# EAGLE design ETAG_v10.0_EM4095 (EAGLE 7.5.0)

## Sheet 1 of 2
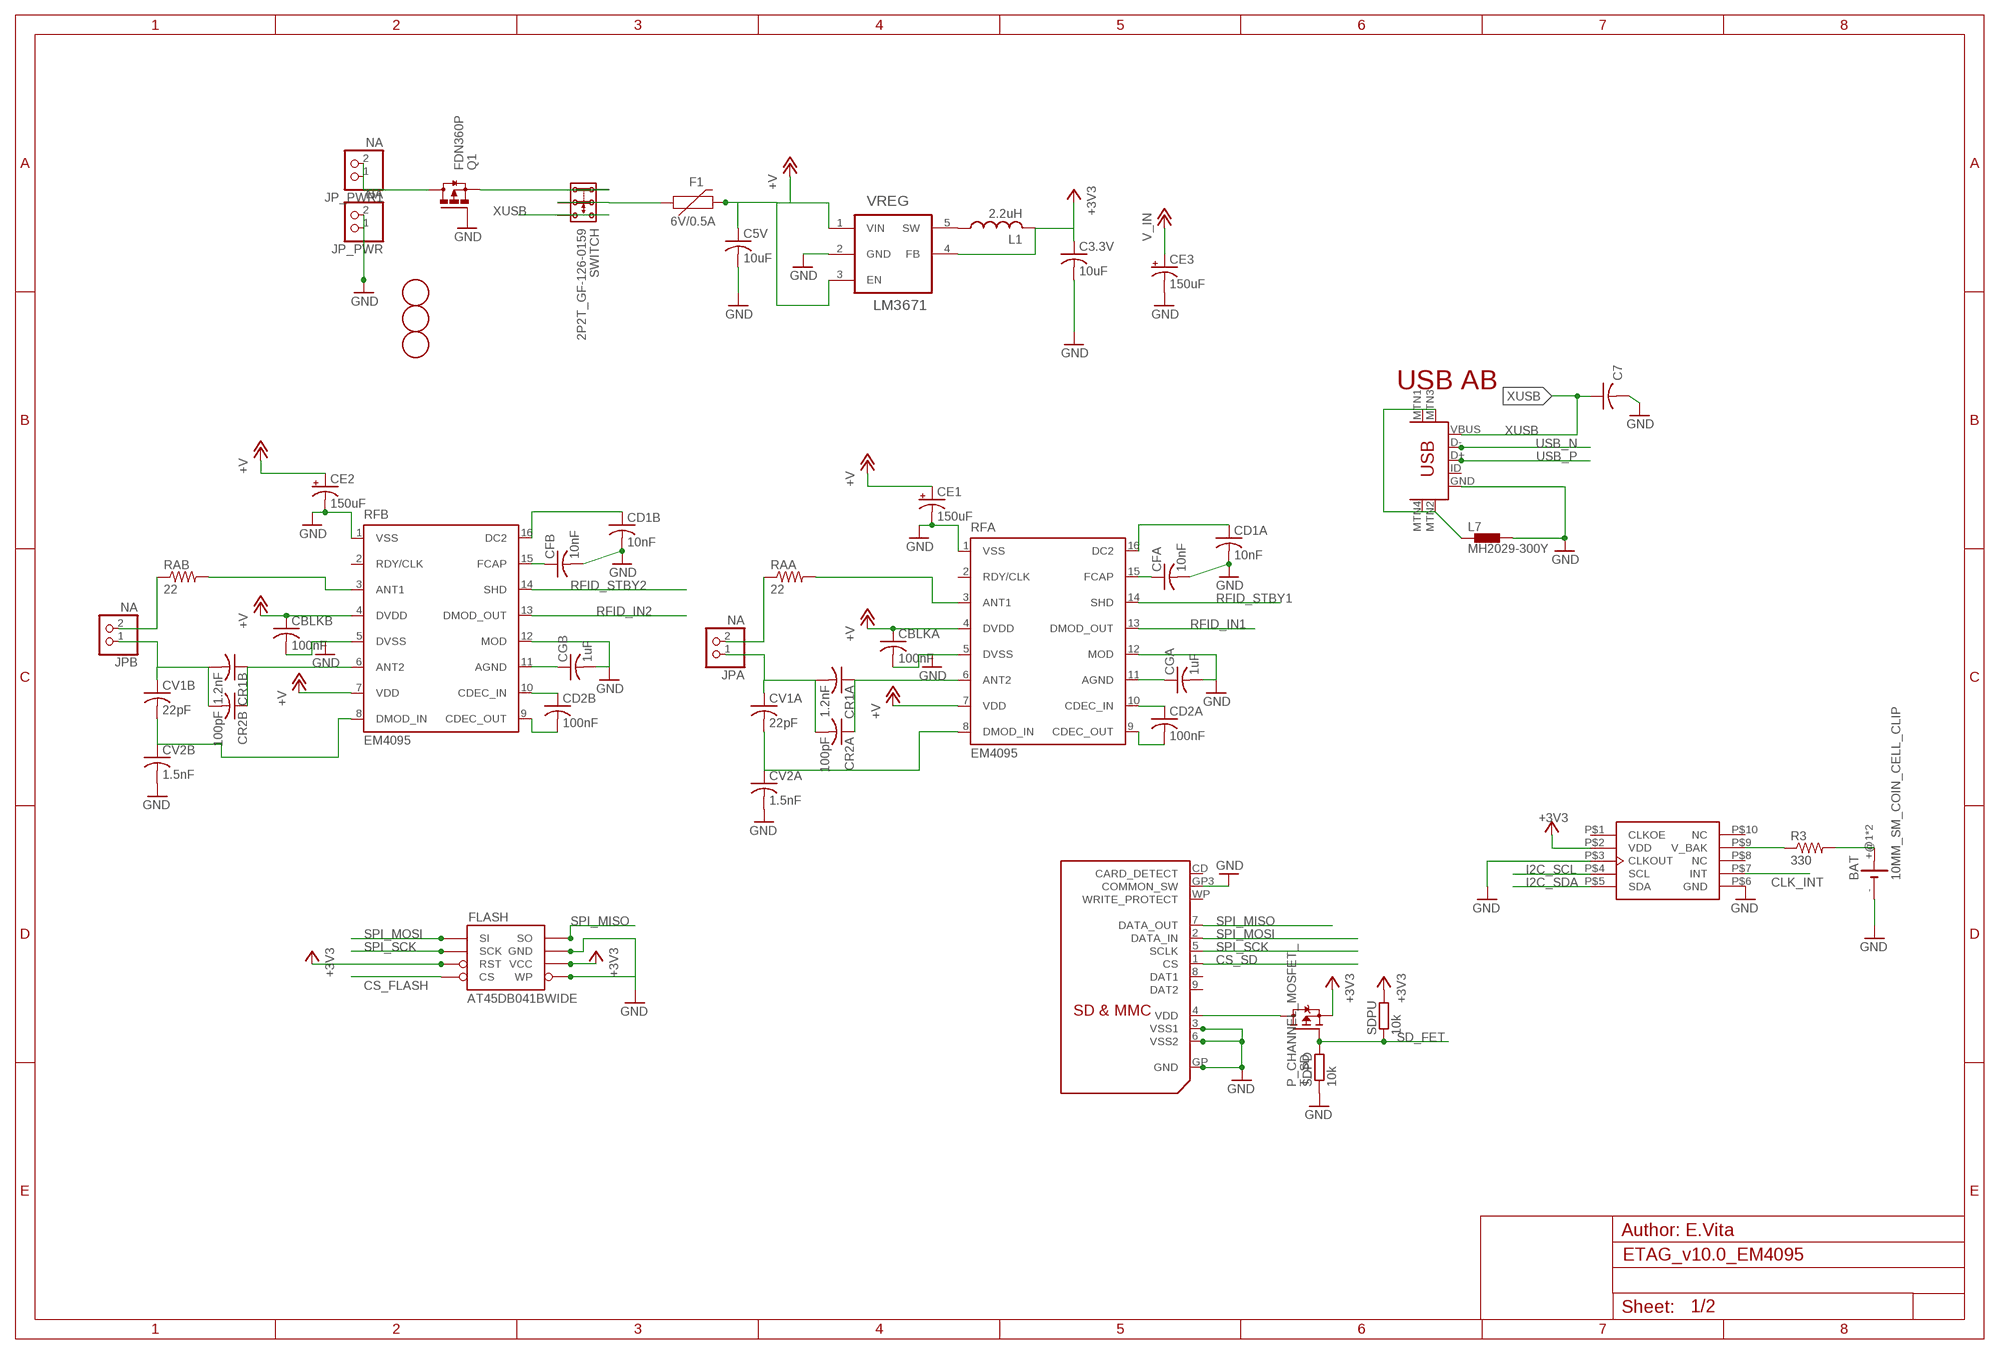
[diagram p0: schematic, sheet 1]

### Parts
BAT  10MM_SM_COIN_CELL_CLIP  [10MM_SM_COIN_CELL_CLIP]
C3.3V  10uF  C-USC0805  [C0805]
C5V  10uF  C-USC0805  [C0805]
C7  10nF  C-USROUND  [C0603-ROUND]
CBLKA  100nF  C-US  [C0603-ROUND]
CBLKB  100nF  C-US  [C0603-ROUND]
CD1A  10nF  C-US  [C0603-ROUND]
CD1B  10nF  C-USROUND  [C0603-ROUND]
CD2A  100nF  C-US  [C0603-ROUND]
CD2B  100nF  C-US  [C0603-ROUND]
CE1  150uF  CPOL-USE2-5  [E2-5]
CE2  150uF  CPOL-USE2-5  [E2-5]
CE3  150uF  CPOL-USE2-5  [E2-5]
CFA  10nF  C-USROUND  [C0603-ROUND]
CFB  10nF  C-US  [C0603-ROUND]
CGA  1uF  C-US  [C0603-ROUND]
CGB  1uF  C-US  [C0603-ROUND]
CR1A  1.2nF  C-USROUND  [C0603-ROUND]
CR1B  1.2nF  C-US  [C0603-ROUND]
CR2A  100pF  C-US  [C0603-ROUND]
CR2B  100pF  C-US  [C0603-ROUND]
CV1A  22pF  C-US  [C0603-ROUND]
CV1B  22pF  C-US  [C0603-ROUND]
CV2A  1.5nF  C-USROUND  [C0603-ROUND]
CV2B  1.5nF  C-US  [C0603-ROUND]
F1  6V/0.5A  PPTC_6V500MA-2  [1206]
FD1  FIDUCIALMOUNT  [FIDUCIA-MOUNT]
FD2  FIDUCIALMOUNT  [FIDUCIA-MOUNT]
FD3  FIDUCIALMOUNT  [FIDUCIA-MOUNT]
FLASH  AT45DB041BWIDE  [SO08WIDE]
JP_PWR  NA  PINHD-1X2  [1X02]
JP_PWR1  NA  PINHD-1X2  [1X02]
JPA  NA  PINHD-1X2  [1X02]
JPB  NA  PINHD-1X2  [1X02]
L1  2.2uH  L-US4X4  [SMT_COIL_INDUCTOR_4X4MM]
L7  MH2029-300Y  BLM15H0805  [C0805K]
Q1  FDN360P  [SUPER-SOT3]
R3  330  R-US_ROUND  [C0603-ROUND]
RAA  22  R-US_R0805  [R0805]
RAB  22  R-US_R0805  [R0805]
RFA  EM4095  [SO16]
RFB  EM4095  [SO16]
RTC  MC-RTC-RV-3029-C3-I2C  [MC-RTC-C3_SPECIAL]
SD  SDMMC06132  [06132]
SDPD  10k  0028_CR0603JW103L  [R0603-ROUND]
SDPU  10k  0028_CR0603JW103L  [R0603-ROUND]
SWITCH  2P2T_GF-126-0159  [2P2T_GF-126-0159]
T_SD  P_CHANNEL_MOSFET_  [SOT23]
USB  USB-MINIB-5PIN  [USB-MINIB]
VREG  LM3671  LM3671_SWITCHING_REGSOT23  [SOT23-5L]

### Nets
2GND [gnd]: L7.1 USB.MTN1(MTN2) USB.MTN2(MTN3) USB.MTN3(MTN1) USB.MTN4
12_IN: JP_PWR1.1 JP_PWR1.2 Q1.3(D)
+3V3: C3.3V.1 FLASH.3(RST) FLASH.6(VCC) L1.P$2 RTC.P$2(VDD) SDPU.2 T_SD.2(S) VREG.4(FB) ; also sheet 2
CLK_INT: RTC.P$7(INT) ; also sheet 2
CS_FLASH: FLASH.4(CS) ; also sheet 2
CS_SD: SD.1(CS) ; also sheet 2
CVB: CR1B.2 CR2B.2 CV1B.1 JPB.1
GND [gnd]: BAT.- C3.3V.2 C5V.2 C7.2 CBLKA.2 CBLKB.2 CD1A.2 CD1B.2 CE1.- CE2.- CE3.- CFA.2 CFB.2 CGA.2 CGB.2 CV2A.2 CV2B.2 FLASH.5(WP) FLASH.7(GND) JP_PWR.1 JP_PWR.2 L7.2 Q1.1(G) RFA.1(VSS) RFA.5(DVSS) RFA.12(MOD) RFB.1(VSS) RFB.5(DVSS) RFB.12(MOD) RTC.P$3(CLKOUT) RTC.P$6(GND) SD.3(VSS1) SD.6(VSS2) SD.GP3(COMMON_SW) SD.GP(GND) SDPD.1 USB.GND VREG.2(GND) ; also sheet 2
I2C_SCL: RTC.P$4(SCL) ; also sheet 2
I2C_SDA: RTC.P$5(SDA) ; also sheet 2
N$2: CFB.1 RFB.15(FCAP)
N$3: CGB.1 RFB.11(AGND)
N$4: CFA.1 RFA.15(FCAP)
N$5: CGA.1 RFA.11(AGND)
N$6: CD1A.1 RFA.16(DC2)
N$7: CR1B.1 CR2B.1 RFB.6(ANT2)
N$8: CV1B.2 CV2B.1 RFB.8(DMOD_IN)
N$9: CD1B.1 RFB.16(DC2)
N$10: F1.1 SWITCH.P2A(2.1) SWITCH.P2B(2.2)
N$11: CD2B.2 RFB.9(CDEC_OUT)
N$12: CR1A.1 CR2A.1 RFA.6(ANT2)
N$13: CV1A.2 CV2A.1 RFA.8(DMOD_IN)
N$14: CR1A.2 CR2A.2 CV1A.1 JPA.1
N$15: CD2B.1 RFB.10(CDEC_IN)
N$16: RAB.2 RFB.3(ANT1)
N$17: Q1.2(S) SWITCH.P1A(1.1) SWITCH.P1B(1.2)
N$18: CD2A.2 RFA.9(CDEC_OUT)
N$19: CD2A.1 RFA.10(CDEC_IN)
N$20: RAA.2 RFA.3(ANT1)
N$21: R3.1 RTC.P$9(V_BAK)
N$22: JPB.2 RAB.1
N$23: BAT.+@1(+) BAT.+@2(+) R3.2
N$35: JPA.2 RAA.1
RFID_IN1: RFA.13(DMOD_OUT) ; also sheet 2
RFID_IN2: RFB.13(DMOD_OUT) ; also sheet 2
RFID_STBY1: RFA.14(SHD) ; also sheet 2
RFID_STBY2: RFB.14(SHD) ; also sheet 2
SD_FET: SDPD.2 SDPU.1 T_SD.1(G) ; also sheet 2
SPI_MISO: FLASH.8(SO) SD.7(DATA_OUT) ; also sheet 2
SPI_MOSI: FLASH.1(SI) SD.2(DATA_IN) ; also sheet 2
SPI_SCK: FLASH.2(SCK) SD.5(SCLK) ; also sheet 2
SW: L1.P$1 VREG.5(SW)
USB_N: USB.D- ; also sheet 2
USB_P: USB.D+ ; also sheet 2
V_IN: C5V.1 CBLKA.1 CBLKB.1 CE1.+ CE2.+ CE3.+ F1.2 RFA.4(DVDD) RFA.7(VDD) RFB.4(DVDD) RFB.7(VDD) VREG.1(VIN) VREG.3(EN) ; supply symbol labelled +V ; also sheet 2
VDD: SD.4(VDD) T_SD.3(D)
XUSB [usbvcc]: C7.1 SWITCH.P3A(3.1) SWITCH.P3B(3.2) USB.VBUS
Unconnected: RFA.2(RDY/CLK) RFB.2(RDY/CLK) RTC.P$1(CLKOE) RTC.P$8(NC) RTC.P$10(NC) SD.8(DAT1) SD.9(DAT2) SD.CD(CARD_DETECT) SD.WP(WRITE_PROTECT) USB.ID

### Notes on the sheet
- USB AB
- Author: E.Vita

## Sheet 2 of 2
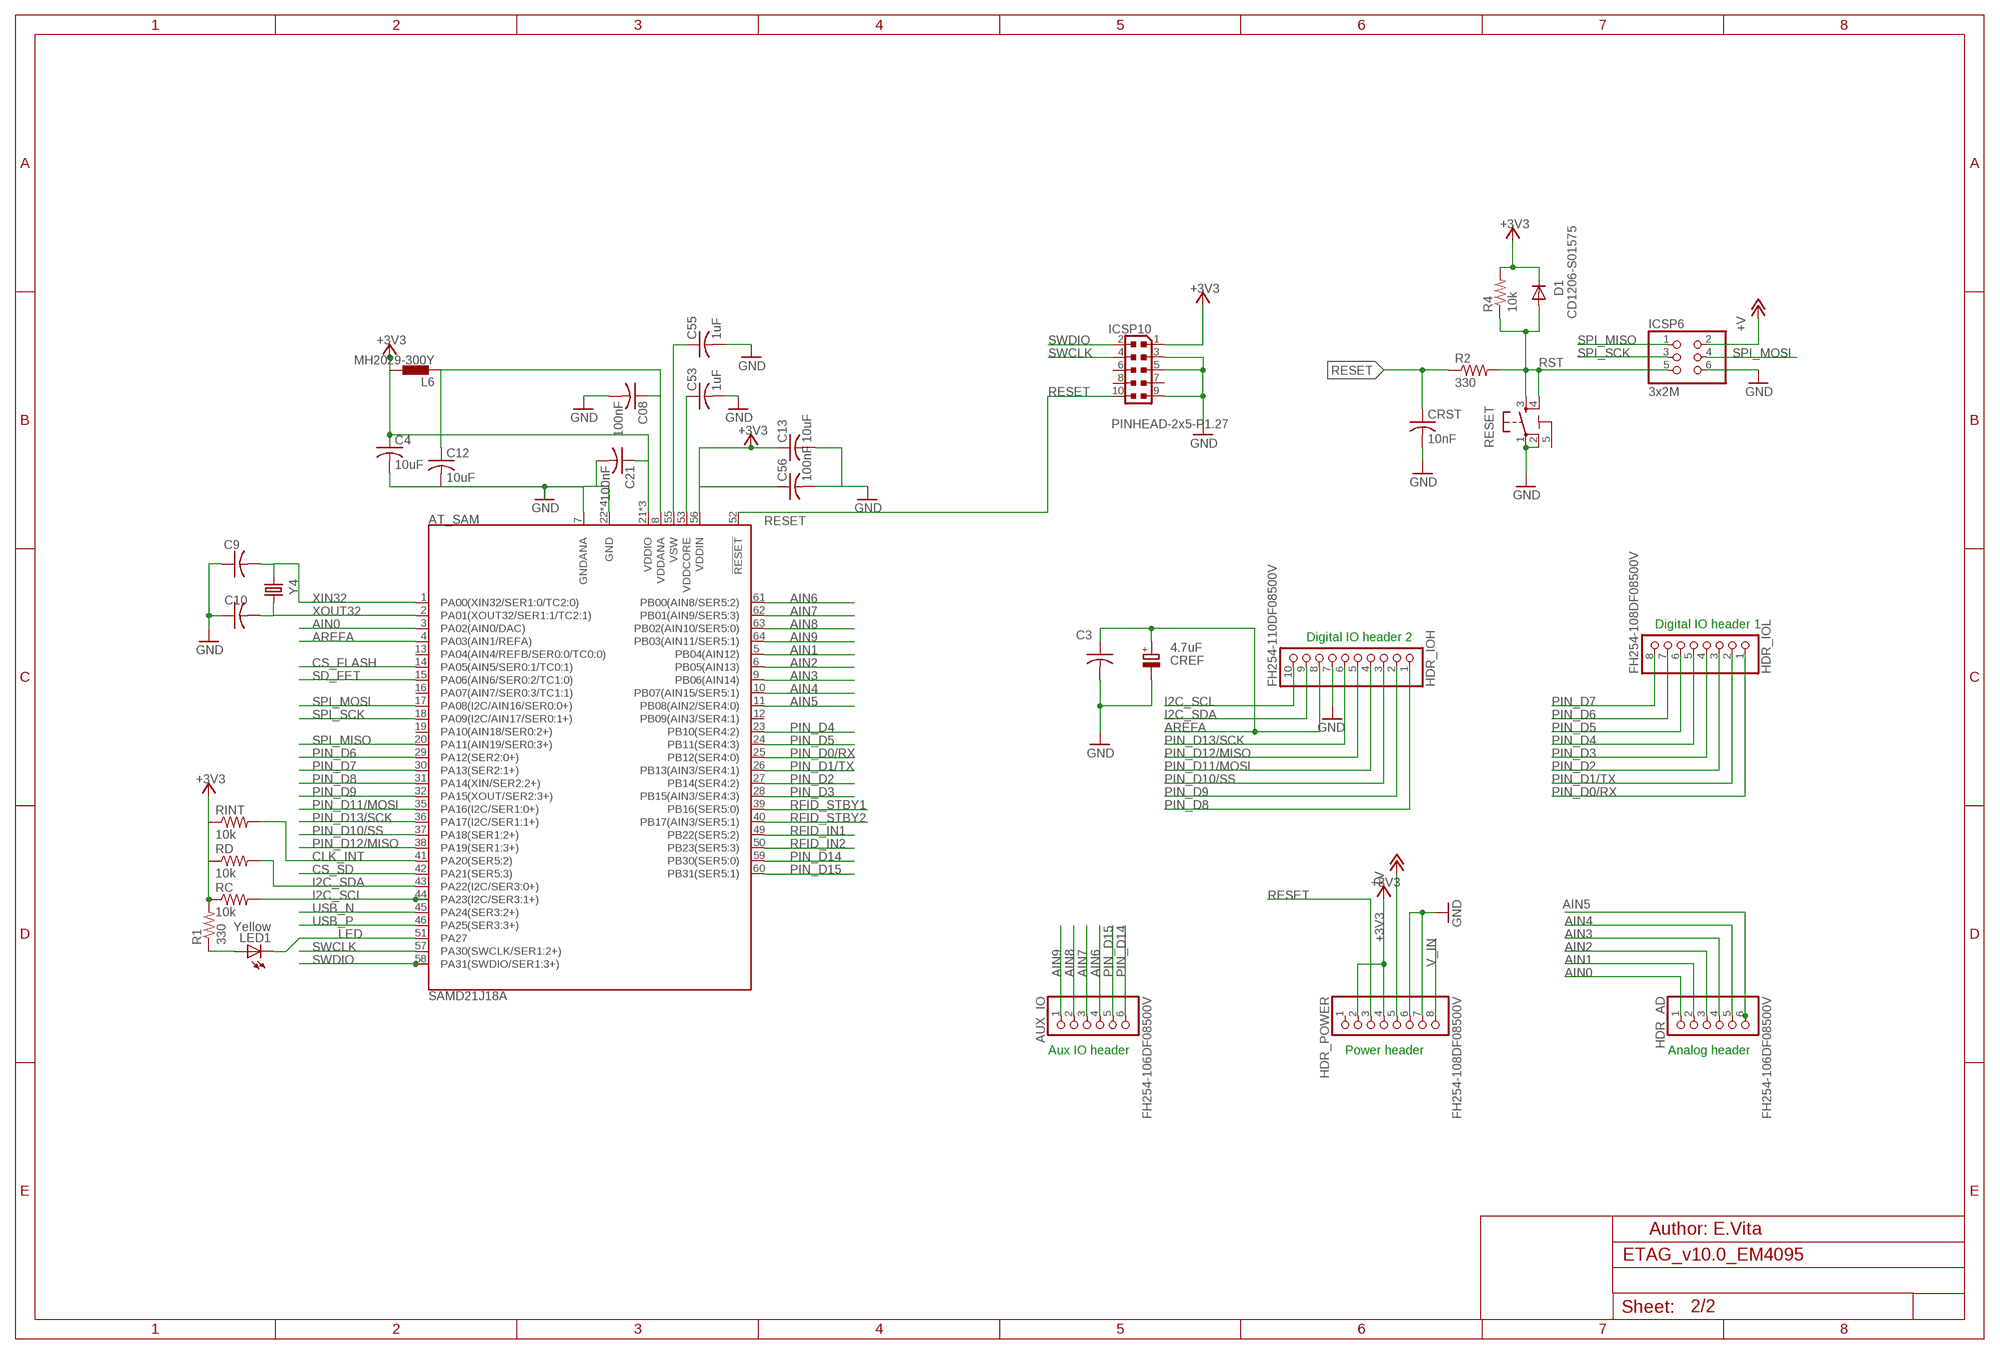
[diagram p1: schematic, sheet 2]

### Parts
AT_SAM  SAMD21J18A  ATSAML21JTQFP_10MM_0.5PITCH  [TQFP_10MM_0.5PITCH]
AUX_IO  FH254-106DF08500V  1682_20TW-535_STD  [1X06]
C3  100nF  C-USROUND  [C0603-ROUND]
C4  10uF  C-USC0805  [C0805]
C08  100nF  C-USROUND  [C0603-ROUND]
C9  22pF  C-USROUND  [C0603-ROUND]
C10  22pF  C-USROUND  [C0603-ROUND]
C12  10uF  C-USC0805  [C0805]
C13  10uF  C-USC0805  [C0805]
C21  100nF  C-USROUND  [C0603-ROUND]
C53  1uF  C-USROUND  [C0603-ROUND]
C55  1uF  C-USROUND  [C0603-ROUND]
C56  100nF  C-USROUND  [C0603-ROUND]
CREF  4.7uF  0474_TAJA475M016RNJ  [SMC_A]
CRST  10nF  C-USROUND  [C0603-ROUND]
D1  CD1206-S01575  0012_CD1206-S01575  [MINIMELF]
HDR_AD  FH254-106DF08500V  1682_20TW-535_STD  [1X06]
HDR_IOH  FH254-110DF08500V  1684_20TW-537  [1X10]
HDR_IOL  FH254-108DF08500V  1683_20TW-536  [1X08]
HDR_POWER  FH254-108DF08500V  1683_20TW-536  [1X08]
ICSP6  3x2M  0114_PH254-203DF118A00V  [2X03]
ICSP10  PINHEAD-2x5-P1.27  0171_PH127-205DF055G00AROUND-PADS  [PINHEAD_2X05_127]
L6  MH2029-300Y  BLM15H0805  [C0805K]
LED1  Yellow  0044_KPT-2012YC  [CHIPLED_0805]
R1  330  R-US_ROUND  [C0603-ROUND]
R2  330  R-US_ROUND  [C0603-ROUND]
R4  10k  R-US_ROUND  [C0603-ROUND]
RC  10k  R-US_ROUND  [C0603-ROUND]
RD  10k  R-US_ROUND  [C0603-ROUND]
RESET  TS42031-160R-TR-7260  0946_TS42031-160W-TR-7260  [TS42]
RINT  10k  R-US_ROUND  [C0603-ROUND]
Y4  32,768Khz  0213_ABS07-32.768KHZ-T  [RESONATOR_EPSON_FC_145]

### Nets
+3V3: AT_SAM.21(VDDIO) AT_SAM.34(VDDIO) AT_SAM.48(VDDIO) AT_SAM.56(VDDIN) C4.1 C13.1 C21.1 C56.1 D1.C HDR_POWER.2 HDR_POWER.4 ICSP10.1 L6.2 R1.2 R4.2 RC.1 RD.1 RINT.1 ; also sheet 1
AIN0: AT_SAM.3(PA02(AIN0/DAC)) HDR_AD.1
AIN1: AT_SAM.5(PB04(AIN12)) HDR_AD.2
AIN2: AT_SAM.6(PB05(AIN13)) HDR_AD.3
AIN3: AT_SAM.9(PB06(AIN14)) HDR_AD.4
AIN4: AT_SAM.10(PB07(AIN15/SER5:1)) HDR_AD.5
AIN5: AT_SAM.11(PB08(AIN2/SER4:0)) HDR_AD.6
AIN6: AT_SAM.61(PB00(AIN8/SER5:2)) AUX_IO.4
AIN7: AT_SAM.62(PB01(AIN9/SER5:3)) AUX_IO.3
AIN8: AT_SAM.63(PB02(AIN10/SER5:0)) AUX_IO.2
AIN9: AT_SAM.64(PB03(AIN11/SER5:1)) AUX_IO.1
AREFA: AT_SAM.4(PA03(AIN1/REFA)) C3.1 CREF.+ HDR_IOH.8
CLK_INT: AT_SAM.41(PA20(SER5:2)) RINT.2 ; also sheet 1
CS_FLASH: AT_SAM.14(PA05(AIN5/SER0:1/TC0:1)) ; also sheet 1
CS_SD: AT_SAM.42(PA21(SER5:3)) ; also sheet 1
GND [gnd]: AT_SAM.7(GNDANA) AT_SAM.22(GND) AT_SAM.33(GND) AT_SAM.47(GND) AT_SAM.54(GND) C3.2 C4.2 C08.2 C9.1 C10.1 C12.2 C13.2 C21.2 C53.2 C55.2 C56.2 CREF.- CRST.2 HDR_IOH.7 HDR_POWER.6 HDR_POWER.7 ICSP6.6 ICSP10.3 ICSP10.5 ICSP10.9 RESET.1 RESET.2 ; also sheet 1
I2C_SCL: AT_SAM.44(PA23(I2C/SER3:1+)) HDR_IOH.10 RC.2 ; also sheet 1
I2C_SDA: AT_SAM.43(PA22(I2C/SER3:0+)) HDR_IOH.9 RD.2 ; also sheet 1
LED: AT_SAM.51(PA27) LED1.C
N$1: LED1.A R1.1
N$24: AT_SAM.53(VDDCORE) C53.1
N$25: AT_SAM.55(VSW) C55.1
PIN_D0/RX: AT_SAM.25(PB12(SER4:0)) HDR_IOL.1
PIN_D1/TX: AT_SAM.26(PB13(AIN3/SER4:1)) HDR_IOL.2
PIN_D2: AT_SAM.27(PB14(SER4:2)) HDR_IOL.3
PIN_D3: AT_SAM.28(PB15(AIN3/SER4:3)) HDR_IOL.4
PIN_D4: AT_SAM.23(PB10(SER4:2)) HDR_IOL.5
PIN_D5: AT_SAM.24(PB11(SER4:3)) HDR_IOL.6
PIN_D6: AT_SAM.29(PA12(SER2:0+)) HDR_IOL.7
PIN_D7: AT_SAM.30(PA13(SER2:1+)) HDR_IOL.8
PIN_D8: AT_SAM.31(PA14(XIN/SER2:2+)) HDR_IOH.1
PIN_D9: AT_SAM.32(PA15(XOUT/SER2:3+)) HDR_IOH.2
PIN_D10/SS: AT_SAM.37(PA18(SER1:2+)) HDR_IOH.3
PIN_D11/MOSI: AT_SAM.35(PA16(I2C/SER1:0+)) HDR_IOH.4
PIN_D12/MISO: AT_SAM.38(PA19(SER1:3+)) HDR_IOH.5
PIN_D13/SCK: AT_SAM.36(PA17(I2C/SER1:1+)) HDR_IOH.6
PIN_D14: AT_SAM.59(PB30(SER5:0)) AUX_IO.6
PIN_D15: AT_SAM.60(PB31(SER5:1)) AUX_IO.5
RESET: AT_SAM.52(!RESET!) CRST.1 HDR_POWER.3 ICSP10.10 R2.1
RFID_IN1: AT_SAM.49(PB22(SER5:2)) ; also sheet 1
RFID_IN2: AT_SAM.50(PB23(SER5:3)) ; also sheet 1
RFID_STBY1: AT_SAM.39(PB16(SER5:0)) ; also sheet 1
RFID_STBY2: AT_SAM.40(PB17(AIN3/SER5:1)) ; also sheet 1
RST: D1.A ICSP6.5 R2.2 R4.1 RESET.3 RESET.4
SD_FET: AT_SAM.15(PA06(AIN6/SER0:2/TC1:0)) ; also sheet 1
SPI_MISO: AT_SAM.20(PA11(AIN19/SER0:3+)) ICSP6.1 ; also sheet 1
SPI_MOSI: AT_SAM.17(PA08(I2C/AIN16/SER0:0+)) ICSP6.4 ; also sheet 1
SPI_SCK: AT_SAM.18(PA09(I2C/AIN17/SER0:1+)) ICSP6.3 ; also sheet 1
SWCLK: AT_SAM.57(PA30(SWCLK/SER1:2+)) ICSP10.4
SWDIO: AT_SAM.58(PA31(SWDIO/SER1:3+)) ICSP10.2
USB_N: AT_SAM.45(PA24(SER3:2+)) ; also sheet 1
USB_P: AT_SAM.46(PA25(SER3:3+)) ; also sheet 1
V_IN: HDR_POWER.5 HDR_POWER.8 ICSP6.2 ; supply symbol labelled +V ; also sheet 1
VDDANA: AT_SAM.8(VDDANA) C08.1 C12.1 L6.1
XIN32: AT_SAM.1(PA00(XIN32/SER1:0/TC2:0)) C9.2 Y4.P$1
XOUT32: AT_SAM.2(PA01(XOUT32/SER1:1/TC2:1)) C10.2 Y4.P$2
Unconnected: AT_SAM.12(PB09(AIN3/SER4:1)) AT_SAM.13(PA04(AIN4/REFB/SER0:0/TC0:0)) AT_SAM.16(PA07(AIN7/SER0:3/TC1:1)) AT_SAM.19(PA10(AIN18/SER0:2+)) HDR_POWER.1 ICSP10.6 ICSP10.7 ICSP10.8

### Notes on the sheet
- Digital IO header 1
- Digital IO header 2
- Aux IO header | Power header | Analog header
- Author: E.Vita

## Power pins joined to a net without a drawn wire
5-GND: RESET.5(5-GND)

## Library data of the parts
AT_SAM = greg-MCU:ATSAML21J: Atmel SAML21J ARM Cortex-M0+ Microcontroller The Atmel ® | SMART ™ SAM L21 is a series of low-power microcontrollers using the 32-bit ARM ® Cortex ® -M0+ processor, and ranging from 32- to 64-pins with up to 256KB Flash and 32KB of SRAM. The SAM L21 devices operate at a maximum frequency of 48MHz and reach 2.46 CoreMark/MHz. They are designed for simple and intuitive migration with identical peripheral modules, hex compatible code, identical linear address map and pin compatible migration paths between all devices in the product series. All devices include intelligent and flexible peripherals, Atmel Event System for inter-peripheral signaling, and support for capacitive touch button, slider and wheel user interfaces.
AUX_IO HDR_AD = Connettori:1682_20TW-535: Female Gray Connector strip for Arduino 3V3 bases - 6x1 F V h 8,5 p2,54; MONTHLY_USAGE: 86722.85; PART_NUMBER: 20TW-535; PRICE: _0.03; SUPPLIER: CBC_elettronica__s.r.l.; TYPE: Connettori
BAT = battery:10MM_SM_COIN_CELL_CLIP: Battery cell clip for CR927 Source: KEYSTONE ELECTRONICS CORP. www.keyelco.com, ASTORIA, N.Y. 11105-2017 PART ANME 10mm SM COIN CELl CLIP DWG NO. 3030
C3 C3.3V C4 C5V C7 C08 C9 C10 C12 C13 C21 C53 C55 C56 CBLKA CBLKB CD1A CD1B CD2A CD2B CFA CFB CGA CGB CR1A CR1B CR2A CR2B CRST CV1A CV1B CV2A CV2B = rcl:C-US: CAPACITOR, American symbol
CE1-CE3 = rcl:CPOL-US: POLARIZED CAPACITOR, American symbol
CREF = Condensatori:0474_TAJA475M016RNJ: 4u7 tantalio Case A - testa gialla -Tantalio; CASE: CaseA_(1206); MONTHLY_USAGE: _____; PART_NUMBER: TAJA475M016RNJ; PRICE: _____; SUPPLIER: _____; TYPE: Condensatori; VALUE: 4u7
D1 = Diodi:0012_CD1206-S01575: small-signal high-speed Switching Diodes CD1206; CASE: 1206; MONTHLY_USAGE: _____; PART_NUMBER: CD1206-S01575; PRICE: _____; SUPPLIER: _____; TYPE: Diodi
F1 = SparkFun-Fuses:PPTC: Resettable Fuse PPTC Resettable Fuse. Really a sort of resistor with a polymeric positive temperature coefficient whose resistance increases dramatically with an increase in temperature. When heated by the power passing through the resistance rises causing the current to be limited, protecting the circuit. This is achieved by the transition of the polymer from a crystalline to an amorphous state where the conductive carbon separates breaking the conductive pathways found in the cool crystalline structure. When a PPTC cools back down it resumes conducting letting the circuit turn back on. SparkFun Products: SparkFun RedBoard - Programmed with Arduino <https://www.sparkfun.com/products/12757> Pro Micro - 5V/16MHz <https://www.sparkfun.com/products/12640> Arduino Pro 328 - 5V/16MHz <https://www.sparkfun.com/products/10915> MP3 Trigger <https://www.sparkfun.com/products/13720>; PROD_ID: RES-08585
FD1-FD3 = SmartPrj:FIDUCIALMOUNT
FLASH = SparkFun-DigitalIC:AT45DB041B: 4-Mbit SPI flash memory
HDR_IOH = Connettori:1684_20TW-537: Female Gray Connector strip for Arduino 3V3 bases - 10x1 F V h 8,5 p2,54mm; MONTHLY_USAGE: _____; PART_NUMBER: 20TW-537; PRICE: _____; SUPPLIER: _____; TYPE: Connettori
HDR_IOL HDR_POWER = Connettori:1683_20TW-536: Female Gray Connector strip for Arduino 3V3 bases - 8x1 F V h 8,5 p2,54mm; MONTHLY_USAGE: _____; PART_NUMBER: 20TW-536; PRICE: _____; SUPPLIER: _____; TYPE: Connettori
ICSP6 = Connettori:0114_PH254-203DF118A00V: 3x2 M V h 8,5 mm p2,54; MONTHLY_USAGE: _____; PART_NUMBER: PH254-203DF118A00V; PRICE: _____; SUPPLIER: _____; TYPE: Connettori; VALUE: ICSP
ICSP10 = Connettori:0171_PH127-205DF055G00A: 2x5 PASSO 1,27
JP_PWR JP_PWR1 JPA JPB = pinhead:PINHD-1X2: PIN HEADER
L1 = rcl:L-US: INDUCTOR, American symbol
L6 L7 = inductors:BLM15H: EMIFIL (R) Chip Ferrite Bead for GHz Noise Source: http://www.murata.com/ Ferrite Bead BLM15H.pdf
LED1 = Opto:0044_KPT-2012YC: LED YELLOW - SMD - 0805; MONTHLY_USAGE: _____; PART_NUMBER: KPT-2012YC; PRICE: _____; SUPPLIER: _____; TYPE: Opto
Q1 = transistor-power:FDN360P: Single P-Channel, PowerTrench (R) MOSFET Source: http://www.fairchildsemi.com/ds/FD/FDN360P.pdf
R1-R4 RAA RAB RC RD RINT = rcl:R-US_: RESISTOR, American symbol
RESET = Switches:0946_TS42031-160W-TR-7260: Pushbutton 6x6 Smd - White; MONTHLY_USAGE: _____; PART_NUMBER: IT-1157AHNP-160G-G_GTR; PRICE: _____; SUPPLIER: _____; TYPE: Switches; VALUE: TS42
RFA RFB = em-microelectronic:EM4095: Read/Write analog front end for 125kHz RFID Basestation Source: http://www.emmicroelectronic.com/webfiles/Product/RFID/DS/EM4095_DS.pdf
RTC = Microcrystal-RTC:MC-RTC-RV-3029-C3-I2C: Microcrystal RV-3029-C3 Real Time Clock Module with I2C-Bus Extremely Accurate RTC Module with embedded Xtal. I2C Interface Temperature Compensation Automotive qualified, according to AEC-Q200 Rev. C Option A: Calibrated Temperature Time Deviation @ +25°C ± 0.26 s/day ± 3ppm 0°C to +50°C ± 0.35 s/day ± 4ppm -10°C to +60°C ± 0.44 s/day ± 5ppm -40°C to +85°C ± 0.52 s/day ± 6ppm -40°C to +125°C ± 0.70 s/day ± 8ppm Option B: Default Temperature Time Deviation @ +25°C ± 0.26 s/day ± 3ppm 0°C to +50°C ± 0.44 s/day ± 5ppm -10°C to +60°C ± 0.87 s/day ±10ppm -40°C to +85°C ± 2.17 s/day ±25ppm -40°C to +125°C ± 2.60 s/day ±30ppm
SD = microbuilder:SDMMC: SD MMC Card holder 4UCON part #06132 - easy to solder
SDPD SDPU = Resistenze:0028_CR0603JW103L: 10K 0603; CASE: 0603; MONTHLY_USAGE: _____; PART_NUMBER: CR0603JW103L; PRICE: _____; SUPPLIER: _____; TYPE: Resistenze
SWITCH = switch:2P2T_GF-126-0159
T_SD = transistor-fet:P_CHANNEL_MOSFET_
USB = USB_miniB:USB-MINIB
VREG = Texas Instruments:LM3671_SWITCHING_REG
Y4 = Cristalli:0213_ABS07-32.768KHZ-T: 32,768KHz - SMD; MONTHLY_USAGE: _____; PART_NUMBER: ABS07-32.768KHZ-T; PRICE: _____; SUPPLIER: _____; TYPE: Cristalli; VALUE: 32,768Khz_SMD

## Net classes
1 USB: width 0.203 mm, drill 0.305 mm, clearance 0.178 mm
2 gnd: width 0.254 mm, drill 0.254 mm, clearance 0.178 mm
3 usbvcc: width 0.203 mm, drill 0.406 mm, clearance 0.178 mm
4 USBpair: width 0.254 mm, drill 0.406 mm, clearance 0.406 mm

## Board
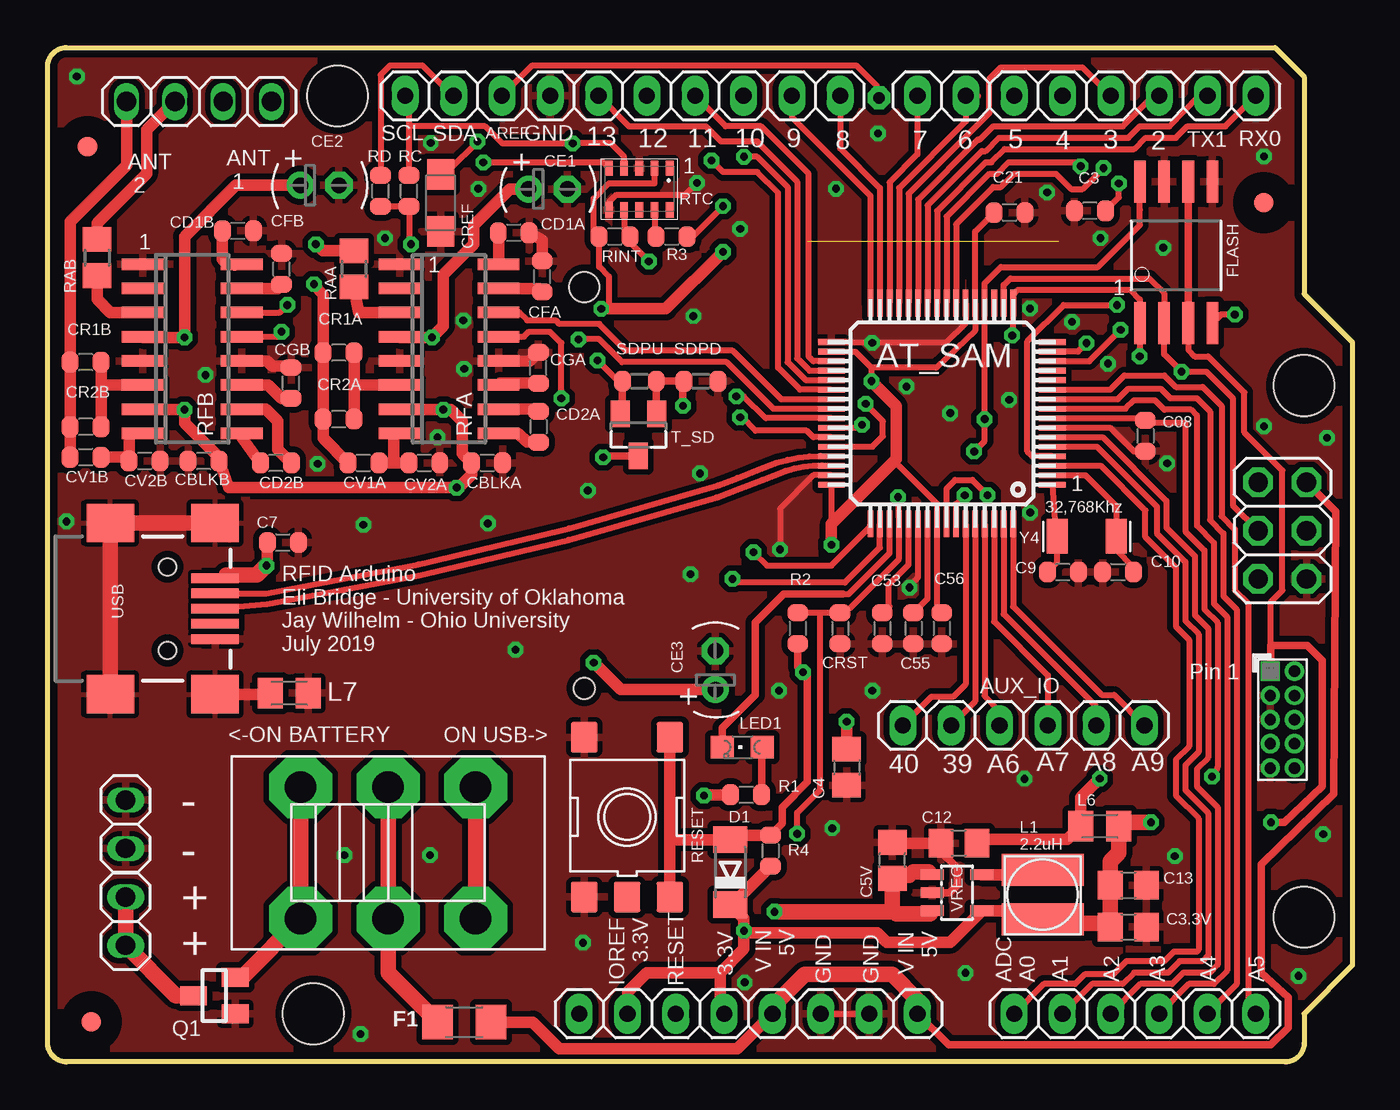
[diagram p2: board, top side]
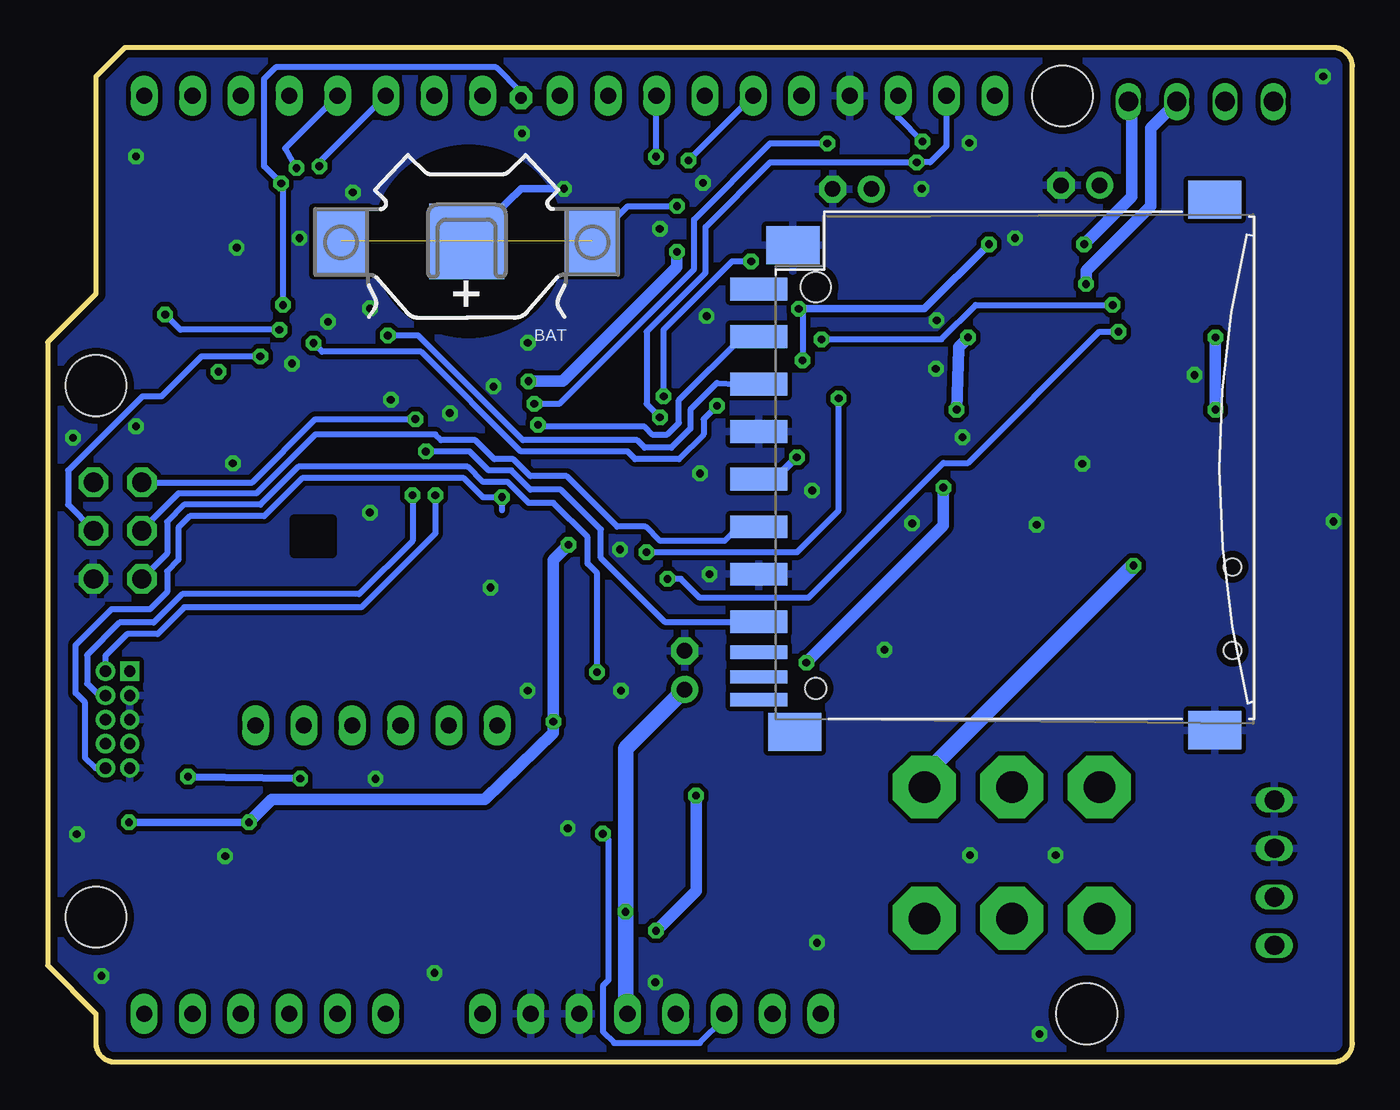
[diagram p3: board, bottom side, seen from below]

Size 68.58 x 53.34 mm. Coordinates in mm from the lower left corner, seen from the top.
Outline: 64.52,53.34 66.04,51.82 66.04,40.39 68.58,37.85 68.58,5.08 66.04,2.54 66.04,1 arc-90 65.04,0 1,0 arc-90 0,1 0,52.34 arc-90 1,53.34 64.52,53.34
Copper layers (1*2+15*16): Top 0.035mm / dielectric 0.5mm / layer 2 0.035mm / dielectric 0.4mm / layer 15 0.035mm / dielectric 0.5mm / Bottom 0.035mm
Design rules "ArduinoUno *": minimum track width 6mil, minimum drill 16mil, track to track 6mil, track to pad 6mil, pad to pad 4mil, via to via 6mil, smd to smd 4mil, copper to edge 15mil, drill to drill 10mil, minimum pad ring 6mil, minimum via ring 4.5mil, stop-mask expansion 1mil, vias tented up to drill 32mil, thermal gap 10mil
Holes 3.2 mm at 66.04,35.56 66.04,7.62 15.24,50.8 13.97,2.54
bRestrict: area 43.7,40.4 to 49.2,45.9

### Footprints (pad centres in the part's own frame; a part is rotated, then mirrored left to right if it is on the bottom)
TQFP_10MM_0.5PITCH = smd 1.4 x 0.3: 1 -5.8,3.75; 2 -5.8,3.25; 3 -5.8,2.75; 4 -5.8,2.25; 5 -5.8,1.75; 6 -5.8,1.25; 7 -5.8,0.75; 8 -5.8,0.25; 9 -5.8,-0.25; 10 -5.8,-0.75; 11 -5.8,-1.25; 12 -5.8,-1.75; 13 -5.8,-2.25; 14 -5.8,-2.75; 15 -5.8,-3.25; 16 -5.8,-3.75; 33 5.8,-3.75; 34 5.8,-3.25; 35 5.8,-2.75; 36 5.8,-2.25; 37 5.8,-1.75; 38 5.8,-1.25; 39 5.8,-0.75; 40 5.8,-0.25; 41 5.8,0.25; 42 5.8,0.75; 43 5.8,1.25; 44 5.8,1.75; 45 5.8,2.25; 46 5.8,2.75; 47 5.8,3.25; 48 5.8,3.75 | smd 0.3 x 1.4: 17 -3.75,-5.8; 18 -3.25,-5.8; 19 -2.75,-5.8; 20 -2.25,-5.8; 21 -1.75,-5.8; 22 -1.25,-5.8; 23 -0.75,-5.8; 24 -0.25,-5.8; 25 0.25,-5.8; 26 0.75,-5.8; 27 1.25,-5.8; 28 1.75,-5.8; 29 2.25,-5.8; 30 2.75,-5.8; 31 3.25,-5.8; 32 3.75,-5.8; 49 3.75,5.8; 50 3.25,5.8; 51 2.75,5.8; 52 2.25,5.8; 53 1.75,5.8; 54 1.25,5.8; 55 0.75,5.8; 56 0.25,5.8; 57 -0.25,5.8; 58 -0.75,5.8; 59 -1.25,5.8; 60 -1.75,5.8; 61 -2.25,5.8; 62 -2.75,5.8; 63 -3.25,5.8; 64 -3.75,5.8
1X06 = drill 0.85 pad 1.422 long: 1 -6.35,0; 2 -3.81,0; 3 -1.27,0; 4 1.27,0; 5 3.81,0; 6 6.35,0
10MM_SM_COIN_CELL_CLIP = smd 2.9 x 3.5: +@1 -6.6,0; +@2 6.6,0 | smd 3.96 x 3.96: - 0,0
C0603-ROUND = smd 0.898 x 1.1: 1 -0.813,0; 2 0.813,0
C0805 = smd 1.3 x 1.5: 1 -0.95,0; 2 0.95,0
E2-5 = drill 0.813 pad 1.422: + -1.016,0 | drill 0.813 pad 1.422 octagon: - 1.016,0
SMC_A = smd 1.6 x 1.4: + -1.5,0; - 1.5,0
MINIMELF = smd 1.4 x 1.8: A 1.7,0; C -1.7,0
1206 = smd 1.6 x 1.8: 1 -1.4,0; 2 1.4,0
FIDUCIA-MOUNT = smd 1.016 x 1.016: P$1 0,0
SO08WIDE = smd 0.61 x 2.21: 1 -1.905,-3.569; 2 -0.635,-3.569; 3 0.635,-3.569; 4 1.905,-3.569; 5 1.905,3.886; 6 0.635,3.886; 7 -0.635,3.886; 8 -1.905,3.886
1X10 = drill 0.85 pad 1.422 long: 1 -11.43,0; 2 -8.89,0; 3 -6.35,0; 4 -3.81,0; 5 -1.27,0; 6 1.27,0; 7 3.81,0; 8 6.35,0; 9 8.89,0; 10 11.43,0
1X08 = drill 0.85 pad 1.422 long: 1 -8.89,0; 2 -6.35,0; 3 -3.81,0; 4 -1.27,0; 5 1.27,0; 6 3.81,0; 7 6.35,0; 8 8.89,0
2X03 = drill 1.016 pad 1.55 octagon: 1 -2.54,-1.27; 2 -2.54,1.27; 3 0,-1.27; 4 0,1.27; 5 2.54,-1.27; 6 2.54,1.27
PINHEAD_2X05_127 = drill 0.6 pad 1.016 square: 1 -0.635,2.54 | drill 0.6 pad 1.016: 2 0.635,2.54; 3 -0.635,1.27; 4 0.635,1.27; 5 -0.635,0; 6 0.635,0; 7 -0.635,-1.27; 8 0.635,-1.27; 9 -0.635,-2.54; 10 0.635,-2.54
1X02 = drill 1.016 long: 1 -1.27,0; 2 1.27,0
SMT_COIL_INDUCTOR_4X4MM = smd 1.7 x 4.3: P$1 -1.3,0; P$2 1.3,0
C0805K = smd 1.3 x 1.6: 1 -1,0; 2 1,0
CHIPLED_0805 = smd 1.2 x 1.2: A 0,-1.05; C 0,1.05
SUPER-SOT3 = smd 1 x 1.4: 1 -0.95,-1.1; 2 0.95,-1.1; 3 0,1.1
R0805 = smd 1.3 x 1.5: 1 -0.95,0; 2 0.95,0
TS42 = smd 1.6 x 1.4: 1 -4.2,2.25; 2 4.2,2.25; 3 -4.2,-2.25; 4 4.2,-2.25; 5 -4.2,0
SO16 = smd 0.6 x 2.2: 1 -4.445,-2.6; 2 -3.175,-2.6; 3 -1.905,-2.6; 4 -0.635,-2.6; 5 0.635,-2.6; 6 1.905,-2.6; 7 3.175,-2.6; 8 4.445,-2.6; 9 4.445,2.6; 10 3.175,2.6; 11 1.905,2.6; 12 0.635,2.6; 13 -0.635,2.6; 14 -1.905,2.6; 15 -3.175,2.6; 16 -4.445,2.6
MC-RTC-C3_SPECIAL = smd 0.4 x 0.8: P$1 -1.6,-1.1; P$2 -0.8,-1.1; P$3 0,-1.1; P$4 0.8,-1.1; P$5 1.6,-1.1; P$6 1.6,1.1; P$7 0.8,1.1; P$8 0,1.1; P$9 -0.8,1.1; P$10 -1.6,1.1
06132 = smd 1.2 x 3: 1 6.9,0.9; 2 4.4,0.9; 3 1.9,0.9; 4 -0.6,0.9; 5 -3.1,0.9; 6 -5.6,0.9; 7 -8.1,0.9; 9 9.4,0.9 | smd 0.7 x 3: 8 -9.7,0.9; CD -11,0.9; WP -12.2,0.9 | smd 2 x 2.8: GP -13.8,-23.07; GP2 14.1,-23.07; GP3 11.7,-0.9; GP4 -13.9,-1 | hole 1.1: -11.6,-2.1 | hole 1.6: 9.5,-2.1
R0603-ROUND = smd 0.898 x 1.1: 1 -0.889,0; 2 0.889,0
2P2T_GF-126-0159 = drill 1.651 pad 3.302 octagon: P1A -4.597,3.454; P1B -4.597,-3.454; P2A 0,3.454; P2B 0,-3.454; P3A 4.597,3.454; P3B 4.597,-3.454
SOT23 = smd 1 x 1.4: 1 -0.95,-1.1; 2 0.95,-1.1; 3 0,1.1
USB-MINIB = smd 2.5 x 0.5: D+ 2.5,0; D- 2.5,0.8; GND 2.5,-1.6; ID 2.5,-0.8; VBUS 2.5,1.6 | smd 2.5 x 2: MTN1 -3,4.5; MTN2 2.5,4.5; MTN3 -3,-4.5; MTN4 2.5,-4.5 | hole 0.9: 0,2.2; 0,-2.2
SOT23-5L = smd 0.55 x 1.2: 1 -0.95,-1.3; 2 0,-1.3; 3 0.95,-1.3; 4 0.95,1.3; 5 -0.95,1.3
RESONATOR_EPSON_FC_145 = smd 1.1 x 1.8: P$1 -1.55,0; P$2 1.55,0

### Placement (x,y rotation side)
AT_SAM  47,34.1 180 top
AUX_IO  51.3,17.7 180 top
BAT  46.55,43.15 180 bottom
C3  54.78,44.76 180 top
C3.3V  56.8,7.1 0 top
C4  42,15.5 270 top
C5V  44.4,10.6 90 top
C7  12.37,27.31 0 top
C08  57.7,32.93 270 top
C9  53.36,25.76 180 top
C10  56.26,25.76 0 top
C12  47.9,11.5 180 top
C13  56.8,9.3 0 top
C21  50.56,44.66 0 top
C53  43.87,22.8 270 top
C55  45.5,22.8 270 top
C56  46.99,22.8 270 top
CBLKA  23.1,31.5 0 top
CBLKB  8.2,31.6 180 top
CD1A  24.5,43.6 0 top
CD1B  10,43.7 0 top
CD2A  25.8,33.4 270 top
CD2B  12,31.5 180 top
CE1  26.3,45.9 0 top
CE2  14.3,46.1 0 top
CE3  35.1,20.6 90 top
CFA  26,41.3 90 top
CFB  12.3,41.7 90 top
CGA  25.8,36.5 90 top
CGB  12.8,35.7 90 top
CR1A  15.3,37.3 180 top
CR1B  2,36.8 180 top
CR2A  15.3,33.8 180 top
CR2B  2,33.4 180 top
CREF  20.66,45.17 270 top
CRST  41.65,22.8 270 top
CV1A  16.6,31.5 0 top
CV1B  2,31.8 0 top
CV2A  19.8,31.5 0 top
CV2B  5.1,31.6 0 top
D1  35.88,9.98 90 top
F1  21.9,2.1 0 top
FD1  2.1,48.13 180 top
FD2  2.31,2.13 0 top
FD3  63.92,45.19 0 top
FLASH  59.32,42.41 0 top
HDR_AD  57.15,2.54 0 top
HDR_IOH  30.23,50.8 180 top
HDR_IOL  54.61,50.8 180 top
HDR_POWER  36.83,2.54 0 top
ICSP6  64.9,27.94 270 top
ICSP10  64.9,18 0 top
JP_PWR  4.1,12.5 270 top
JP_PWR1  4.1,7.4 90 top
JPA  10.5,50.5 0 top
JPB  5.42,50.5 0 top
L1  52.3,8.8 270 top
L6  55.3,12.4 0 top
L7  12.7,19.4 0 top
LED1  36.51,16.55 90 top
Q1  8.76,3.49 90 top
R1  36.71,14.05 180 top
R2  39.43,22.8 270 top
R3  32.8,43.4 0 top
R4  37.99,11.11 270 top
RAA  16.1,41.7 270 top
RAB  2.6,42.3 270 top
RC  19,45.8 90 top
RD  17.5,45.8 90 top
RESET  30.46,12.88 90 top
RFA  21.1,37.5 270 top
RFB  7.6,37.5 270 top
RINT  29.8,43.4 0 top
RTC  31.1,45.9 180 top
SD  30.31,31.25 90 bottom
SDPD  34.34,35.79 180 top
SDPU  31.1,35.8 180 top
SWITCH  17.9,11 0 top
T_SD  31.06,32.97 180 top
USB  6.3,23.84 0 top
VREG  47.8,8.9 270 top
Y4  54.61,27.64 0 top

### Tracks (layer width: path | path; a pad name or v marks a point on that pad's centre or on a via)
2GND
  Top 0.61: 3.21,28.63 USB.MTN1 | USB.MTN2 9.55,27.59 | L7.1 11.64,19.34 USB.MTN4
  Top 0.813: USB.MTN3 USB.MTN1 USB.MTN2 7.18,28.34
  pour Top: 1.86,29.78 10.49,29.78 10.49,26.76 7.96,26.76 7.96,20.79 10.49,20.79 10.49,17.87 1.86,17.87
12_IN
  Top 0.813: JP_PWR1.2 JP_PWR1.1 6.74,3.49 Q1.3
+3V3  (via drill 0.41)
  Top 0.305: 64.3,21.9 64.3,24.2 64.9,24.8 64.9,31.1 62.9,33.1 62.9,35.2 61,37.1 60.3,37.1 59.95,37.45 FLASH.3 | 29.6,39.6 29.5,39.6 29.5,41.3 28.99,41.81 RINT.1 28.7,43.4 28.7,45.4 29.5,46.2 31.9,46.2 RTC.P$2 | v28.9,36.9 30,35.8 SDPU.2 | RD.1 RC.1 19,43.1 v19.1,43 | C56.1 46.75,24.07 AT_SAM.56 46.75,29.35 44.6,31.5 44.6,31.7 | AT_SAM.48 41.2,28.3 | C21.1 48.75,43.67 AT_SAM.21 48.75,38.45 46.7,36.5 43.3,36.5 | AT_SAM.34 42.45,37.35 43.3,36.5 | 43.3,36.5 v43.3,35.8
  Top 0.406: HDR_POWER.2 30.44,2.5 | 35.42,8.28 D1.C | v64.3,12.6 65,12.6 67,14.5 67,21.1 66.2,21.9 64.3,21.9 64.3,20.58 ICSP10.1 | T_SD.2 30.21,34.07 SDPU.2 | L6.2 56.5,12.6 | FLASH.6 FLASH.3
  Top 0.61: 52.15,7.65 L1.P$2 | D1.C 35.98,8.28 R4.2 | 35.6,8 D1.C | v29.1,39.6 29.6,39.6 32.5,39.6 v35.5,42.6 | L1.P$2 52.5,7.3 | L1.P$2 51.85,7.95 VREG.4 47.45,6.3 44.1,6.3 43.6,6.8 36.7,6.8 v36.6,6.9 | v42,17.9 C4.1 | 35.56,7.96 D1.C | 35.36,4.7 31.5,4.7 30.48,3.68 HDR_POWER.2 | HDR_POWER.4 35.36,2.74 35.36,4.7 | 35.36,4.7 36.6,5.94 v36.6,6.9 | v36.6,6.9 36.6,7.56 D1.C | v34.5,14 34.76,14.05 R1.2 | v41.2,27.2 41.2,28.3 44.6,31.7 44.6,34.5 43.4,35.7 43.3,35.7 v43.3,35.8
  Top 0.813: 52.5,7.3 55.65,7.3 C3.3V.1 C13.1 55.85,10.55 56.3,11 L6.2 | 56.5,12.6 v58,12.6
  Bottom 0.305: v29.1,39.6 28.9,39.4 v28.9,36.9
  Bottom 0.406: v19.1,43 22.5,39.6 v29.1,39.6 | v58,12.6 v64.3,12.6
  Bottom 0.61: v35.5,42.6 35.5,41.8 41.5,35.8 v43.3,35.8 | v41.2,27.2 42,26.4 v42,17.9 42,17.3 45.6,13.8 56.8,13.8 v58,12.6 | v36.6,6.9 34.5,9 v34.5,14
AIN0
  Top 0.305: 50.8,2.7 HDR_AD.1 52.36,4.1 54,4.1 54.5,4.6 56,4.6 56.7,5.3 58.7,5.3 59.2,5.8 60.4,5.8 60.5,5.9 60.5,12.8 59.3,14 59.3,15.9 60,16.6 60,22.2 59.3,22.9 59.3,26 57.7,27.6 57.7,29 55.35,31.35 AT_SAM.3
AIN1
  Top 0.305: 53.37,2.56 HDR_AD.2 54.9,4.1 56.5,4.1 57.1,4.7 58.9,4.7 59.5,5.3 60.7,5.3 61,5.6 61,13.1 59.8,14.3 59.8,15.6 60.5,16.3 60.5,22.5 59.8,23.2 59.8,26.3 58.3,27.8 58.3,29.2 55.15,32.35 AT_SAM.5
AIN2
  Top 0.305: HDR_AD.3 57.44,4.1 59.1,4.1 59.7,4.7 61.1,4.7 61.5,5.1 61.5,13.4 60.4,14.5 60.4,15.4 61,16 61,22.8 60.3,23.5 60.3,26.6 58.8,28.1 58.8,29.5 55.45,32.85 AT_SAM.6
AIN3
  Top 0.305: 58.37,2.59 HDR_AD.4 59.98,4.1 61.3,4.1 62,4.8 62,23.4 61.3,24.1 61.3,27.3 60.4,28.2 60.4,34 60.1,34.3 58.7,34.3 58.2,34.8 57.1,34.8 56.65,34.35 AT_SAM.9
AIN4
  Top 0.305: HDR_AD.5 62.5,4.08 62.5,23.8 61.8,24.5 61.8,27.8 61.1,28.5 61.1,34.2 60.4,34.9 59,34.9 58.5,35.4 56.8,35.4 56.25,34.85 AT_SAM.10
AIN5
  Top 0.305: 63.5,3.2 HDR_AD.6 63.1,2.94 63.1,24.1 62.4,24.8 62.4,28 61.7,28.7 61.7,34.5 60.7,35.5 59.3,35.5 58.7,36.1 56.6,36.1 55.85,35.35 AT_SAM.11
AIN6
  Top 0.305: AT_SAM.61 49.25,19.25 50.03,18.47 AUX_IO.4
AIN7
  Top 0.305: AT_SAM.62 49.75,23.15 52.57,20.33 AUX_IO.3
AIN8
  Top 0.305: AT_SAM.63 50.25,23.55 55.11,18.69 AUX_IO.2
AIN9
  Top 0.305: AUX_IO.1 56.05,19.3 55.4,19.3 50.75,23.95 AT_SAM.64
AREFA  (via drill 0.41, 0.6)
  Top 0.305: HDR_IOH.8 25.48,52.4 42.5,52.4 43.6,51.3 43.4,51 v43.7,50.7 | CREF.+ 21.1,46.91 v22.6,48.4 | AT_SAM.4 51.75,31.85 51.5,32.1 51.5,37.9 53.4,39.8 v56.2,39.8 | C3.1 56.3,45.46 v56.3,46.2
  Bottom 0.305: v43.7,50.7 43.7,51 45,52.3 56.6,52.3 57.2,51.7 57.2,47.1 v56.3,46.2 56.2,46 v56.2,39.8 | 23.88,50.78 HDR_IOH.8 23.88,49.68 v22.6,48.4
CLK_INT  (via drill 0.41)
  Top 0.305: RTC.P$7 30.3,43.81 RINT.2 30.61,43.09 v31.6,42.1 | AT_SAM.41 37.75,33.85 36.6,35 v36.2,35
  Bottom 0.305: v31.6,42.1 32.6,42.1 36.2,38.5 v36.2,35
CS_FLASH  (via drill 0.41)
  Top 0.305: v62.4,39.3 61.68,39.3 FLASH.4 | v56.4,38.5 54.75,36.85 AT_SAM.14
  Bottom 0.305: v56.4,38.5 61.6,38.5 v62.4,39.3
CS_SD  (via drill 0.41)
  Top 0.305: AT_SAM.42 42.75,33.35 v42.8,33.5
  Bottom 0.305: SD.1 32.05,38.15 35.4,34.8 35.4,33.6 36,33 36.8,33 37.2,33.4 42.6,33.4 v42.8,33.5
CVB
  Top 0.61: CV1B.1 CR2B.2 CR1B.2 1.19,44.19 4.15,47.15 JPB.1
GND  (via drill 0.41)
  Top 0.305: HDR_POWER.6 HDR_POWER.7 | RTC.P$6 29.5,45.2 29.9,45.6 33.52,45.6 v34.14,46.22 | AT_SAM.7 55.85,33.35 57.09,32.11 C08.2 | v45.3,24.95 45.75,25.5 AT_SAM.54 | AT_SAM.47 40.25,30.85 38.5,29.1 v38.5,26.95 | AT_SAM.33 43.34,37.85 v43.34,37.82 47.22,37.82 48.25,38.85 AT_SAM.22
  Top 0.406: v45.3,24.95 45.1,24.85 | C12.2 46.95,11.05 47.8,10.2 47.8,9.3 47.4,8.9 VREG.2
  Top 0.61: C5V.2 44.55,11.5 C12.2 | CD1A.2 26,43.21 CFA.2 | RFA.12 25.35,36.87 CGA.2 | RFB.12 11.54,36.87 11.8,36.6 12.71,36.6 CGB.2
  Bottom 0.406: BAT.- 43.68,45.92 v41.44,45.92
  other vias: 8.3,36.12 48.24,4.69 16.45,1.47 16.6,28.25 24.6,21.67 23.14,28.32 28.14,6.27 58.84,31.49 51.34,14.89 36.4,43.8 41.24,12.29 1,28.42 21.85,39 14.2,31.45 52.54,45.72 20.5,32.85 45.14,35.52 50.54,34.82 47.44,34.12 63.94,33.42 67.24,32.82 63.94,47.62 67.04,11.99 65.75,4.53 59.25,10.83 34.3,30.95 33.8,25.65 21.9,36.45 43.64,48.82 20.14,48.32 33.94,39.22 15.6,10.87 20.1,10.87 51.64,39.62 22.64,45.92 1.54,51.82 17.74,43.32 43.35,19.53 38.45,19.53 28.4,30.05 36.64,4.19 55.34,43.32 51.64,28.89 58.64,42.82 53.84,38.92 55.74,36.72
  pour Bottom (isolate 0.254, rank 2): 0.2,53.2 64.4,53.2 66,51.6 66,40.3 68.5,37.8 68.6,5 66,2.4 66,0 0.2,0
  pour Top (isolate 0.305): 0.4,53 64.5,53 65.8,51.7 65.8,40.2 68.3,37.7 68.3,5.2 65.8,2.7 65.8,0.8 65.3,0.3 0.8,0.3 0.3,0.8 0.3,52.9 0.5,52.9
I2C_SCL  (via drill 0.41)
  Top 0.305: RTC.P$4 30.3,47.6 29.6,48.3 v27.6,48.3 23.9,48.3 23,49.2 19,49.2 | RC.2 19,49.2 | 19,49.2 19,50.6 HDR_IOH.10 | AT_SAM.44 43.35,32.35 43.9,32.9 43.9,33.7 v43,34.6
  Bottom 0.305: 27.6,48.2 v27.6,48.3 30.6,48.3 34.6,44.3 34.6,41.7 41.7,34.6 v43,34.6
I2C_SDA  (via drill 0.41)
  Top 0.305: 21.3,50.8 19.7,52.4 18,52.4 17.5,51.9 RD.2 | v22.9,47.3 29.2,47.3 RTC.P$5 | AT_SAM.43 40.25,32.85 39.9,33.2 37.2,33.2 36.5,33.9 v36.4,33.9
  Top 0.406: 21.3,50.8 HDR_IOH.9
  Bottom 0.305: HDR_IOH.9 21.34,48.16 22.2,47.3 v22.9,47.3 30.6,47.3 34,43.9 34,41.5 37.1,38.4 37.1,34.6 v36.4,33.9
LED
  Top 0.305: 41.8,24.6 42.1,24.6 44.25,26.75 AT_SAM.51
  Top 0.406: 41.8,24.6 38.7,24.6 37.2,23.1 37.2,19.3 35.46,17.56 LED1.C
N$1
  Top 0.406: LED1.A 37.53,16.51 R1.1
N$2
  Top 0.61: RFB.15 12.09,40.67 CFB.1
N$3
  Top 0.406: RFB.11 10.22,35.61
  Top 0.61: RFB.11 11.61,35.59 12.31,34.89 CGB.1
N$4
  Top 0.61: CFA.1 25.81,40.67 RFA.15
N$5
  Top 0.61: RFA.11 23.79,35.69 CGA.1
N$6
  Top 0.61: RFA.16 23.7,43.11 CD1A.1
N$7
  Top 0.61: RFB.6 2.81,35.59 | 2.81,35.59 CR1B.1 | CR2B.1 2.81,35.59
N$8
  Top 0.61: RFB.8 4.29,33.05 CV2B.1 4.09,31.8 CV1B.2
N$9
  Top 0.61: CD1B.1 9.19,42.21 9.4,42 9.85,41.9 RFB.16
N$10
  Top 0.813: SWITCH.P2A SWITCH.P2B 17.9,4.7 F1.1
N$11
  Top 0.61: RFB.9 10.85,33.05 10.11,32.99 CD2B.2
N$12
  Top 0.61: CR2A.1 16.11,35.5 | 16.11,35.5 CR1A.1 | RFA.6 16.21,35.59 16.11,35.5
N$13
  Top 0.61: CV1A.2 18.2,31.5 | 18.2,31.5 CV2A.1 | RFA.8 arc90 18.2,32.76 18.2,31.5
N$14  (via drill 0.41)
  Top 0.61: v14,40.9 14.49,40.31 CR1A.2 CR2A.2 14.49,32.8 CV1A.1
  Bottom 0.61: JPA.1 9.23,50.47 10.6,49.1 10.6,45 14,41.6 v14,40.9
N$15
  Top 0.406: 10.24,34.29 RFB.10
  Top 0.61: RFB.10 11.47,34.33 12.1,33.7 12.1,32.21 CD2B.1
N$16
  Top 0.61: RFB.3 3.29,39.41 2.6,40.1 RAB.2
N$17
  Top 0.813: Q1.2 10.3,4.54 SWITCH.P1B SWITCH.P1A
N$18
  Top 0.61: RFA.9 24.75,33.05 25.21,32.59 CD2A.2
N$19
  Top 0.61: RFA.10 25.69,34.33 CD2A.1
N$20
  Top 0.61: RFA.3 16.34,39.41 RAA.2
N$21
  Top 0.305: RTC.P$9 31.9,43.49 R3.1
N$22
  Top 0.61: 2.6,43.3 RAB.1 2.6,44.1 5.2,46.7 5.2,49.01 JPB.2
N$23  (via drill 0.41)  (1 unrouted)
  Top 0.305: R3.2 33.9,43.4 v35.5,45
  Bottom 0.305: BAT.+@1 38.1,45 v35.5,45
N$24
  Top 0.305: 44.2,23.94 44.2,25.1 45.25,26.15 AT_SAM.53
  Top 0.406: C53.1 44.2,23.94
N$25
  Top 0.305: C55.1 46.25,24.36 AT_SAM.55
N$35  (via drill 0.41)
  Top 0.61: RAA.1 14.45,42.65 v14.1,43
  Bottom 0.61: v14.1,43 11.6,45.5 11.6,50.33 JPA.2
PIN_D0/RX
  Top 0.305: HDR_IOL.1 61.9,49.2 59.9,49.2 59.3,48.6 57.7,48.6 57.1,48 50.3,48 49.6,47.3 49.3,47.3 46.75,44.75 AT_SAM.25
PIN_D1/TX
  Top 0.305: HDR_IOL.2 60.5,50.8 58.96,49.2 57.4,49.2 56.8,48.6 50,48.6 49.3,47.9 49.1,47.9 46.25,45.05 AT_SAM.26
PIN_D2
  Top 0.305: HDR_IOL.3 58.12,50.8 56.52,49.2 49.7,49.2 49,48.5 48.9,48.5 45.75,45.35 AT_SAM.27
PIN_D3
  Top 0.305: 55.6,50.8 HDR_IOL.4 54.38,52.3 50.1,52.3 49.5,51.7 49.5,49.9 45.25,45.65 AT_SAM.28
PIN_D4  (via drill 0.41)
  Top 0.305: v55.5,47 54.4,45.9 53.8,45.9 53,46.7 50.8,46.7 50.1,46 49.7,46 47.75,44.05 AT_SAM.23
  Bottom 0.305: v55.5,47 56.1,48.04 HDR_IOL.5
PIN_D5  (via drill 0.41)
  Top 0.305: v54.3,47.1 54.1,47.3 50.5,47.3 49.9,46.7 49.5,46.7 47.25,44.45 AT_SAM.24
  Bottom 0.305: v54.3,47.1 54.3,47.3 HDR_IOL.6
PIN_D6
  Top 0.254: 48.26,50.66 HDR_IOL.7
  Top 0.305: 48.9,50.8 HDR_IOL.7 48.26,49.46 44.75,45.95 AT_SAM.29
PIN_D7
  Top 0.305: HDR_IOL.8 45.72,47.72 44.25,46.25 AT_SAM.30
PIN_D8
  Top 0.305: HDR_IOH.1 41.66,48.04 43.75,45.95 AT_SAM.31
PIN_D9
  Top 0.305: HDR_IOH.2 39.12,49.68 43.25,45.55 AT_SAM.32
PIN_D10/SS  (via drill 0.41)
  Top 0.305: AT_SAM.37 39.85,35.85 38.9,36.8 38.9,46 37.3,47.6 v36.6,47.6
  Bottom 0.305: v36.6,47.6 36.6,50.78 HDR_IOH.3
PIN_D11/MOSI
  Top 0.305: HDR_IOH.4 35.64,49.2 37.5,49.2 40,46.7 40,37.1 40.25,36.85 AT_SAM.35
PIN_D12/MISO  (via drill 0.41)
  Top 0.305: AT_SAM.38 39.55,35.35 38.4,36.5 38.4,45.7 37.3,46.8 35.5,46.8 v34.9,47.4
  Bottom 0.305: v34.9,47.4 HDR_IOH.5
  Bottom 0.406: HDR_IOH.5 31.5,50.5
PIN_D13/SCK
  Top 0.305: HDR_IOH.6 30.56,49.2 34.6,49.2 35.4,48.4 37.3,48.4 39.4,46.3 39.4,37 40.05,36.35 AT_SAM.36
PIN_D14
  Top 0.305: AUX_IO.6 46.45,19.2 47.6,19.2 48.25,19.85 AT_SAM.59
PIN_D15
  Top 0.305: AT_SAM.60 48.75,18.96 AUX_IO.5
RESET  (via drill 0.41)
  Top 0.305: v44.7,29.7 44.7,29.6 AT_SAM.52 44.75,26.45 42.15,23.85 41.95,23.85 CRST.1 40.6,23.61 | 40.6,23.61 R2.1 | v39.4,12 39.4,13.1 40.6,14.3 40.6,23.61
  Top 0.61: HDR_POWER.3 33.02,2.82 33.2,3
  Bottom 0.305: ICSP10.10 66.06,15.46 66.6,16 66.6,18.9 67.1,19.4 67.1,21.93 65.23,23.8 63.2,23.8 62.3,24.7 62.3,25.8 61.7,26.4 61.7,28.1 61.1,28.7 57.2,28.7 55.2,30.7 46.7,30.7 45.7,29.7 v44.7,29.7 44.7,29 | v39.4,12 39.1,11.7 39.1,4.3 39.4,4 39.4,1.6 38.8,1 34.3,1 33.02,2.28 HDR_POWER.3
RFID_IN1  (via drill 0.41)
  Top 0.305: RFA.13 25.04,38.13 25.3,38.4 26.4,38.4 27,37.8 v27,34.9 | v37.1,26.8 37.8,26.1 41.2,26.1 43.25,28.15 AT_SAM.49
  Bottom 0.305: v37.1,26.8 29.2,26.8 27,29 v27,34.9
RFID_IN2  (via drill 0.41)
  Top 0.305: v36,25.4 36.2,25.2 41.9,25.2 43.75,27.05 AT_SAM.50 | RFB.13 12.06,38.13 v12.3,38.4
  Bottom 0.305: v36,25.4 35.3,25.4 34.3,24.4 28.6,24.4 21.5,31.5 20.2,31.5 13.3,38.4 v12.3,38.4
RFID_STBY1
  Top 0.305: RFA.14 24.8,39.41 25.2,39 26.7,39 26.9,38.8 29,38.8 30.4,37.4 36,37.4 38.55,34.85 AT_SAM.39
RFID_STBY2  (via drill 0.41)
  Top 0.305: RFB.14 12.21,39.41 v12.6,39.8 | AT_SAM.40 38.15,34.35 35.7,36.8 30.2,36.8 29,38 v27.9,38
  Bottom 0.305: v27.9,38 21.6,38 19.8,39.8 v12.6,39.8
RST  (via drill 0.41)
  Top 0.406: R4.1 38.6,12.53 38.6,13.4 39.93,14.73 39.93,20.27 v39.7,20.5 39.43,20.77 R2.2
  Top 0.61: R4.1 36.12,11.93 D1.A 32.73,11.68 32.71,11.7 | RESET.3 32.71,11.7 | 32.71,11.7 RESET.4
  Bottom 0.305: v39.7,20.5 39.7,25.7 40.2,26.2 40.2,27.6 42,29.4 43.3,29.4 44.4,30.5 45.7,30.5 46.5,31.3 55.4,31.3 57.4,29.3 61.4,29.3 62.3,28.4 62.3,26.73 ICSP6.5
SD_FET  (via drill 0.41)
  Top 0.305: v54.6,37.8 54.15,37.35 AT_SAM.15
  Top 0.406: T_SD.1 31.99,34.07 SDPU.1 SDPD.2 33.39,35.79 v33.39,34.51
  Bottom 0.305: v54.6,37.8 54.15,37.35 48.95,37.35 43.7,32.1 38.1,32.1 37.7,31.7 35.4,31.7 34.1,33 34.1,33.8 v33.39,34.51
SPI_MISO  (via drill 0.41)
  Top 0.305: v48.7,32.1 49.25,32.65 v49.25,33.8 AT_SAM.20 49.25,40.95 50.1,41.8 55.2,41.8 57.41,44.01 57.41,44.81 57.41,45.3 FLASH.8
  Bottom 0.305: SD.7 36.15,23.15 39.5,26.5 39.5,28 41.6,30.1 43.2,30.1 44.2,31.1 45.4,31.1 46.4,32.1 v48.7,32.1 | ICSP6.1 57.82,30.48 54.5,33.8 v49.25,33.8
SPI_MOSI  (via drill 0.41)
  Top 0.305: v57.4,37.1 57.41,36.99 FLASH.1 57.41,40.09 56.9,40.6 51,40.6 50.75,40.35 AT_SAM.17 50.75,38.25 v50.7,38.2
  Bottom 0.305: ICSP6.4 66.17,27.97 67.5,29.3 67.5,31.1 63.6,35 62.6,35 60.5,37.1 v57.4,37.1 | SD.2 31.25,35.6 33.4,35.7 34.8,34.3 34.8,33.3 35.8,32.3 37.2,32.3 37.6,32.7 43.6,32.7 49.1,38.2 v50.7,38.2
SPI_SCK  (via drill 0.41)
  Top 0.305: ICSP6.3 62.3,29.27 62.3,34.9 60.9,36.3 v59.6,36.3 58.68,37.22 FLASH.2 | AT_SAM.18 50.25,40.85 50.6,41.2 57.9,41.2 58.68,40.42 FLASH.2 | 58.68,39.72 FLASH.2
  Bottom 0.305: ICSP6.3 63.66,27.94 61.7,29.9 57.6,29.9 54.5,33 48.2,33 47.9,32.7 46.1,32.7 45.1,31.7 44.1,31.7 43.2,30.8 41.3,30.8 38.65,28.15 37.15,28.15 36.4,27.4 33,27.4 32.25,28.15 SD.5
SW
  Top 0.61: VREG.5 52.05,9.85 L1.P$1
SWCLK  (via drill 0.41)
  Top 0.305: AT_SAM.57 47.25,30.15 47.7,30.6 48.6,30.6 v49.4,29.8
  Bottom 0.305: ICSP10.4 65.87,19.27 66.5,19.9 66.5,21.4 64.8,23.1 63,23.1 61.5,24.6 52.2,24.6 49.4,27.4 v49.4,29.8
SWDIO  (via drill 0.41)
  Top 0.305: AT_SAM.58 47.75,29.35 v48.2,29.8
  Bottom 0.305: ICSP10.2 65.53,21.37 64.4,22.5 62.8,22.5 61.4,23.9 52.1,23.9 48.2,27.8 v48.2,29.8
USB_N
  Top 0.305: USB.D- 11.48,24.63 arc8 35.23,30.32 arc1 38.33,31.52 arc-20 AT_SAM.45
USB_P
  Top 0.305: USB.D+ 11.54,24.07 arc8 35.17,29.68 arc1 38.77,31.08 arc-22 AT_SAM.46
V_IN  (via drill 0.41)
  Top 0.406: ICSP6.2 67.7,28.95 67.6,14.1 63.8,10.4 63.8,4.7 65.2,3.4 65.2,1.8 64.3,0.9 47.36,0.9 HDR_POWER.8 | VREG.3 46.5,7.8 46.4,7.8 | VREG.1 46.45,9.85 46.3,10
  Top 0.61: 44.45,9.6 C5V.1 | F1.2 25.5,2.1 26.9,0.7 36.26,0.7 HDR_POWER.5 | RFB.7 5.03,34.3 v7.2,34.3 7.2,33.6 9.01,31.79 CBLKB.1 9.51,30.2 v21.5,30.2 21.6,30.2 22.29,30.89 CBLKA.1 21.8,31.99 21.8,33.7 21.2,34.3 v20.8,34.3 18.52,34.3 RFA.7 | CE2.+ 9.9,46.1 7.2,43.4 v7.2,38.1 5.04,38.1 RFB.4 | RFA.4 18.54,38.1 v20.2,38.1 20.8,38.7 20.8,41.4 22.4,43 22.4,44 24.3,45.9 CE1.+ | v28.7,21 30.12,19.58 CE3.+
  Top 0.813: v38.2,7.9 44.4,7.9 | HDR_POWER.8 45.72,3.28 44.4,4.6 39.8,4.6 38.1,2.9 HDR_POWER.5 | 46.4,7.8 44.6,7.8 44.4,7.9 | 46.3,10 45.5,10 45.3,9.8 44.55,9.8 C5V.1 44.4,7.9
  Bottom 0.61: v7.2,38.1 v7.2,34.3 | v20.2,38.1 20.7,37.6 20.7,37.5 v20.8,34.3 | v28.7,21 21.5,28.2 v21.5,30.2
  Bottom 0.813: HDR_POWER.5 38.2,2.8 v38.2,7.9 38.2,16.48 CE3.+
VDD  (via drill 0.41)
  Top 0.406: T_SD.3 29.27,31.87 v29.2,31.8
  Bottom 0.406: v29.2,31.8 30.35,30.65 SD.4
VDDANA  (via drill 0.41)
  Top 0.305: 57.56,33.7 C08.1 57.59,33.85 AT_SAM.8 | v61.2,15 61.5,15.5 61.5,23.1 60.8,23.8 60.8,26.9 59.8,27.9 59.8,33.6 57.84,33.6
  Top 0.406: 57.84,33.6 C08.1
  Top 0.61: C12.1 48.55,11.7 53.6,11.7 L6.1 54.3,13.9 v55.3,14.9
  Bottom 0.406: v55.3,14.9 v61.2,15
XIN32
  Top 0.305: AT_SAM.1 53,27.7 Y4.P$1 53.06,26.27 C9.2
XOUT32
  Top 0.305: AT_SAM.2 54.55,30.85 56.16,29.24 Y4.P$2 56.16,26.94 57.07,26.03 C10.2
XUSB  (via drill 0.41)
  Top 0.406: USB.VBUS 9.4,25.6
  Top 0.61: C7.1 11.54,26.3 v11.5,26.1
  Top 0.813: 9.4,25.6 11,25.6 v11.5,26.1 | SWITCH.P3B SWITCH.P3A
  Bottom 0.813: v11.5,26.1 22.5,15.1 SWITCH.P3A

### Text on the board
tPlace: IOREF / 3.3V | RESET | 3.3V | V IN / 5V | V IN / 5V | GND | GND | ADC / A0 | A1 | A2 | A3 | A4 | A5
tNames: SCL | SDA | AREF | GND | 13 | 12 | 11 | 10 | 9 | 8 | 7 | 6 | 5 | 4 | 3 | 2 | TX1 | RX0 | 1 | ANT / 2 | ANT / 1 | 1 | 1 | 1 | 1 | RFID Arduino / Eli Bridge - University of Oklahoma / Jay Wilhelm - Ohio University / July 2019 | Pin 1 | ON USB-> | <-ON BATTERY | 40 | 39 | A6 | A7 | A8 | A9 | - | L1 / 2.2uH | - | + | +
214bmp: D:/SmartProjects/Snc/a4_bn_logo2.bmp